# Altium schematic sheet IO.SchDoc
size A; SheetNumber: 5; SheetTotal: 5
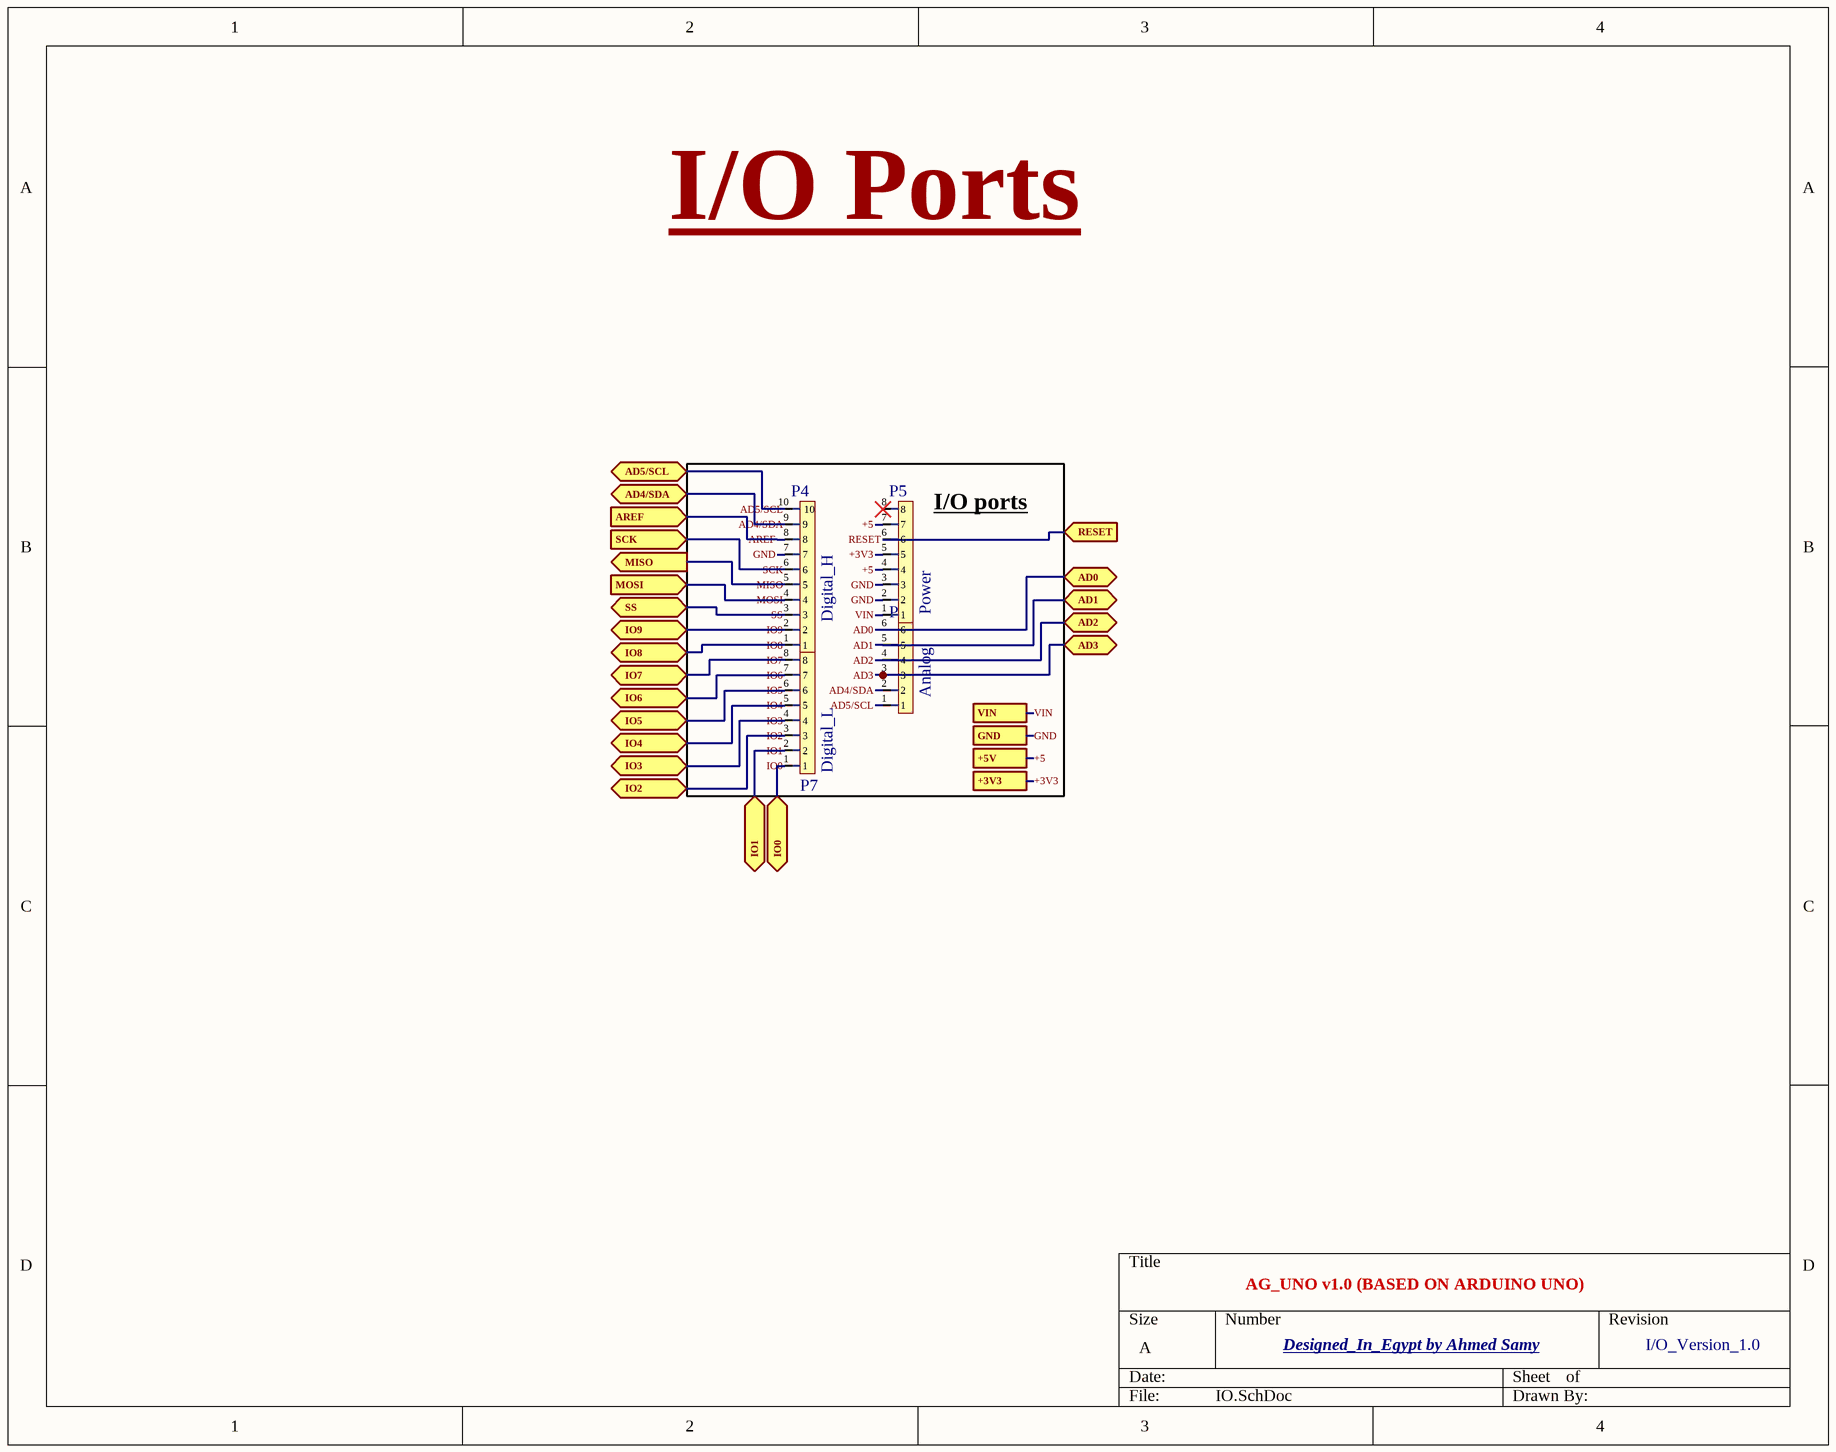
[diagram p0: IO.SchDoc]

## Parts
P4  Digital_H  [NPPN101BFCN-RC]
P5  Power  [PPTC081LFBN-RC]
P6  Analog  [PPTC061LFBN-RC]
P7  Digital_L  [PPTC081LFBN-RC]

## Ports
+3V3, +5V, AD0 (bidir), AD1 (bidir), AD2 (bidir), AD3 (bidir), AD4/SDA (bidir), AD5/SCL (bidir), AREF (in), GND, IO0 (bidir), IO1 (bidir), IO2 (bidir), IO3 (bidir), IO4 (bidir), IO5 (bidir), IO6 (bidir), IO7 (bidir), IO8 (bidir), IO9 (bidir), MISO (out), MOSI (in), RESET (in), SCK (in), SS (bidir), VIN

## Nets
+3V3: P5.5 ; port +3V3
+5: P5.4 P5.7 ; port +5V
AD0: P6.6 ; port AD0
AD1: P6.5 ; port AD1
AD2: P6.4 ; port AD2
AD3: P6.3 ; port AD3
AD4/SDA: P4.9 P6.2 ; port AD4/SDA
AD5/SCL: P4.10 P6.1 ; port AD5/SCL
AREF: P4.8 ; port AREF
GND: P4.7 P5.2 P5.3 ; port GND
IO0: P7.1 ; port IO0
IO1: P7.2 ; port IO1
IO2: P7.3 ; port IO2
IO3: P7.4 ; port IO3
IO4: P7.5 ; port IO4
IO5: P7.6 ; port IO5
IO6: P7.7 ; port IO6
IO7: P7.8 ; port IO7
IO8: P4.1 ; port IO8
IO9: P4.2 ; port IO9
MISO: P4.5 ; port MISO
MOSI: P4.4 ; port MOSI
RESET: P5.6 ; port RESET
SCK: P4.6 ; port SCK
SS: P4.3 ; port SS
VIN: P5.1 ; port VIN

Not connected (* = marked no-connect by the designer): P5 8*

## Notes on the sheet
- I/O Ports
- (near P5) I/O ports
- AG_UNO v1.0 (BASED ON ARDUINO UNO)
- Designed_In_Egypt by Ahmed Samy
- I/O_Version_1.0

## Library data of the parts
P4 = NPPN101BFCN-RC: 10 Position Header Connector 0.079" (2.00mm) Through Hole Gold
P5 P7 = PPTC081LFBN-RC: 8 Position Header Connector 0.100" (2.54mm) Through Hole Tin
P6 = PPTC061LFBN-RC: 6 Position Female Pin Header Connector 0.100" (2.54mm) Through Hole Tin